# EAGLE design reflow_oven (EAGLE 6.5.0)
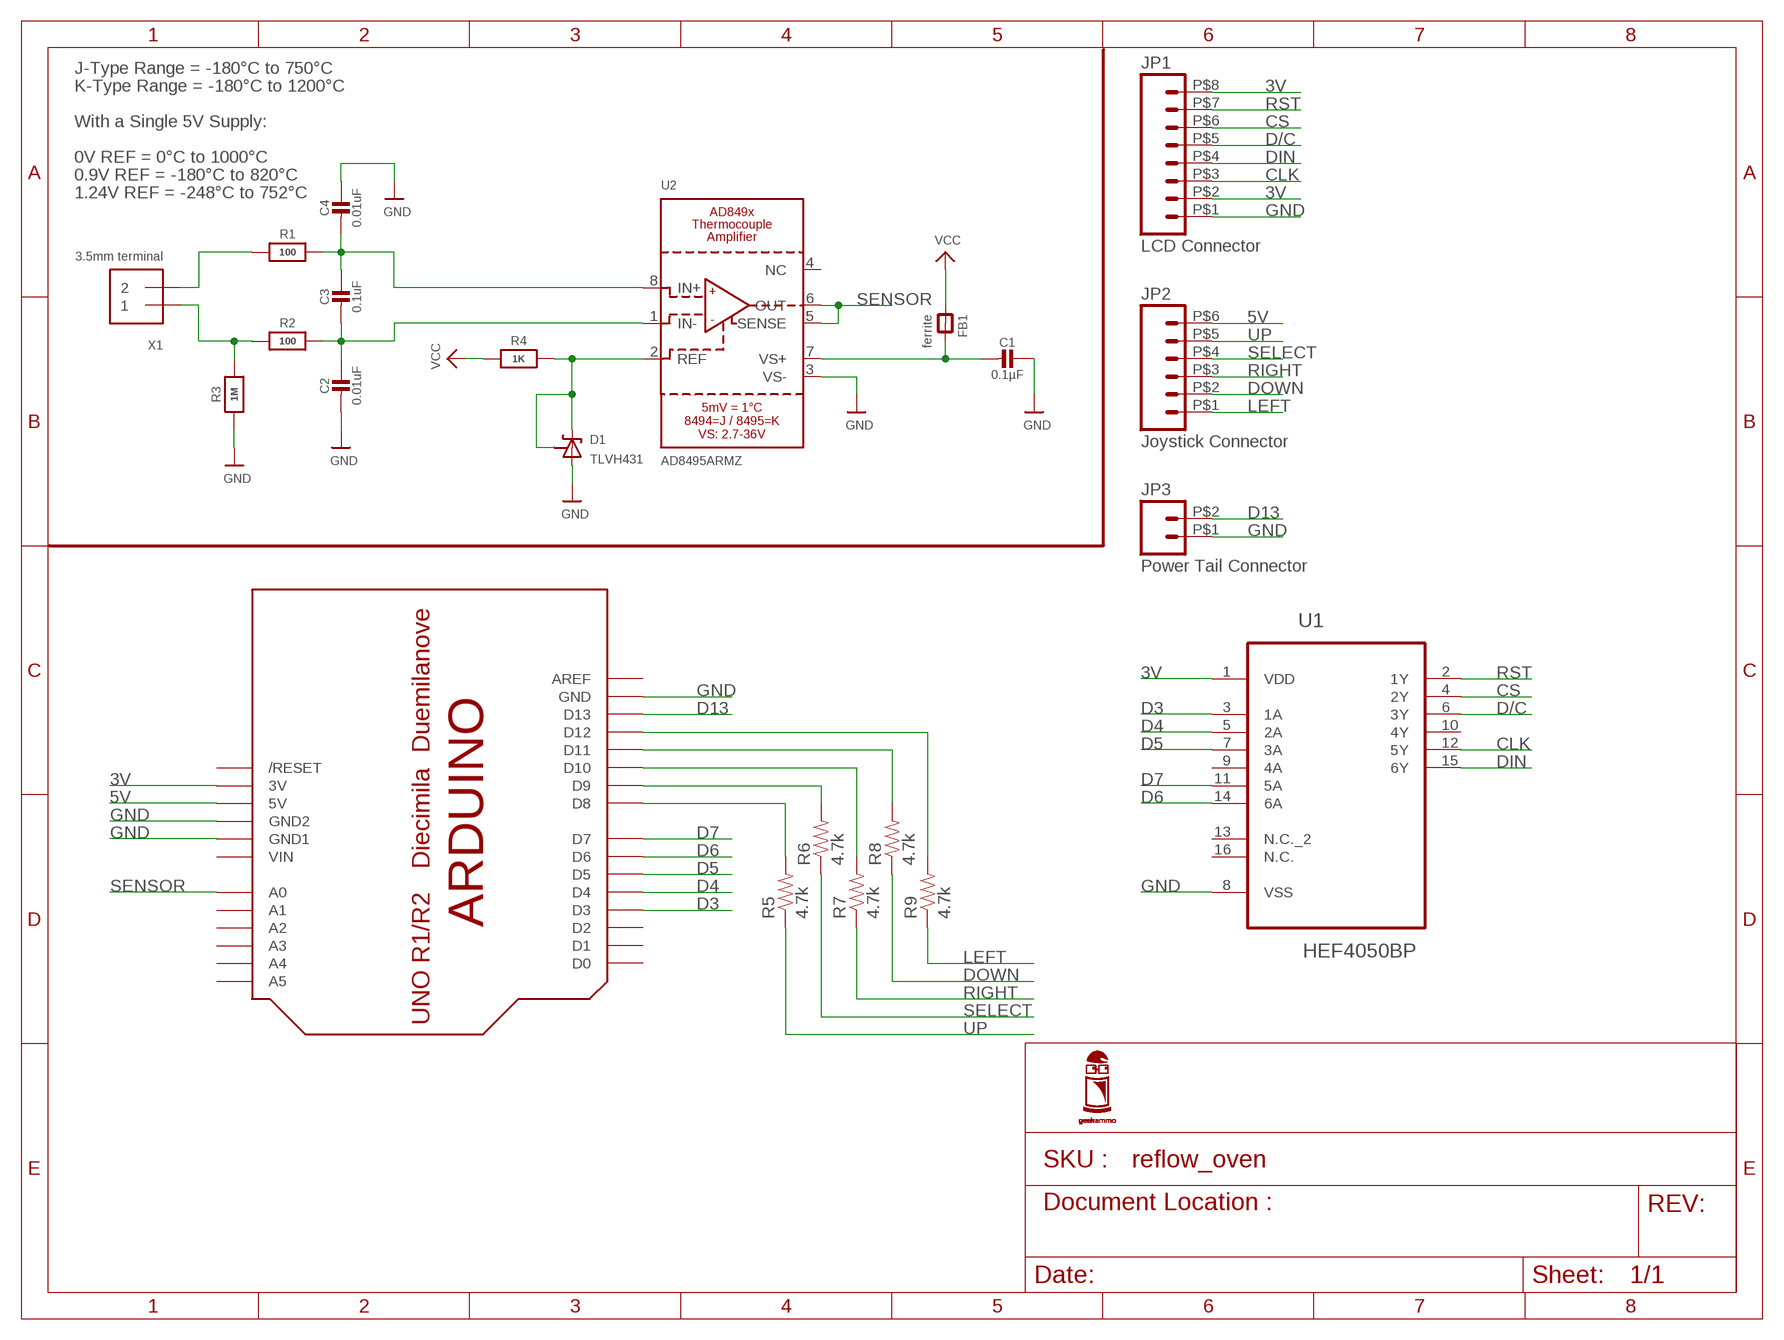
[diagram p0: schematic, sheet 1]

## Parts
C1  0.1µF  CAP_CERAMIC0805-NOOUTLINE  [0805-NO]
C2  0.01uF  CAP_CERAMIC0805-NOOUTLINE  [0805-NO]
C3  0.1uF  CAP_CERAMIC0805-NOOUTLINE  [0805-NO]
C4  0.01uF  CAP_CERAMIC0805-NOOUTLINE  [0805-NO]
D1  TLVH431  SHUNT-VREF  [SOT23-R]
FB1  ferrite  FERRITE0805  [0805]
JP1  LCD Connector  M080.1"-8  [SPRINGTERMINAL-0.1"-8]
JP2  Joystick Connector  M06  [SPRINGTERMINAL-0.1"-6]
JP3  Power Tail Connector  M02SPRING-0.1"  [SPRINGTERMINAL-0.1"-2]
R1  100  RESISTOR0805_NOOUTLINE  [0805-NO]
R2  100  RESISTOR0805_NOOUTLINE  [0805-NO]
R3  1M  RESISTOR0805_NOOUTLINE  [0805-NO]
R4  1K  RESISTOR0805_NOOUTLINE  [0805-NO]
R5  4.7k  RESISTOR0805-RES  [0805]
R6  4.7k  RESISTOR0805-RES  [0805]
R7  4.7k  RESISTOR0805-RES  [0805]
R8  4.7k  RESISTOR0805-RES  [0805]
R9  4.7k  RESISTOR0805-RES  [0805]
U1  HEF4050BP  [DIP254P762X420-16]
U2  AD8495ARMZ  AD849X  [MSOP8_0.65MM]
U$1  ARDUINOUNO  [ARDUINO]
X1  3.5mm terminal  TERMBLOCK_1X2  [TERMBLOCK_1X2-3.5MM]

## Nets
3V: JP1.P$2 JP1.P$8 U1.1(VDD) U$1.3V
5V: JP2.P$6 U$1.5V
CLK: JP1.P$3 U1.12(5Y)
CS: JP1.P$6 U1.4(2Y)
D3: U1.3(1A) U$1.D3
D4: U1.5(2A) U$1.D4
D5: U1.7(3A) U$1.D5
D6: U1.14(6A) U$1.D6
D7: U1.11(5A) U$1.D7
D8: R5.2 U$1.D8
D13: JP3.P$2 U$1.D13
D/C: JP1.P$5 U1.6(3Y)
DIN: JP1.P$4 U1.15(6Y)
DOWN: JP2.P$2 R8.1
GND: C1.1 C2.2 C4.1 D1.3(A) JP1.P$1 JP3.P$1 R3.1 U1.8(VSS) U2.3(VS-) U$1.GND U$1.GND1 U$1.GND2
IN+: R1.1 X1.2
IN-: R2.1 R3.2 X1.1
LEFT: JP2.P$1 R9.1
N$1: D1.1(VREF) D1.2(C) R4.2 U2.2(REF)
N$2: C3.1 C4.2 R1.2 U2.8(IN+)
N$3: C2.1 C3.2 R2.2 U2.1(IN-)
N$4: C1.2 FB1.2 U2.7(VS+)
N$6: R6.2 U$1.D9
N$7: R7.2 U$1.D10
N$8: R8.2 U$1.D11
N$12: R9.2 U$1.D12
RIGHT: JP2.P$3 R7.1
RST: JP1.P$7 U1.2(1Y)
SELECT: JP2.P$4 R6.1
SENSOR: U2.5(SENSE) U2.6(OUT) U$1.A0
UP: JP2.P$5 R5.1
VCC: FB1.1 R4.1
Unconnected: U1.9(4A) U1.10(4Y) U1.13(N.C._2) U1.16(N.C.) U2.4(NC) U$1.A1 U$1.A2 U$1.A3 U$1.A4 U$1.A5 U$1.AREF U$1.D0 U$1.D1 U$1.D2 U$1.RESET(/RESET)

## Notes on the sheet
- J-Type Range = -180°C to 750°C
- K-Type Range = -180°C to 1200°C
- With a Single 5V Supply:
- 0V REF = 0°C to 1000°C
- 0.9V REF = -180°C to 820°C
- 1.24V REF = -248°C to 752°C

## Power pins joined to a net without a drawn wire
VIN: U$1.VIN

## Library data of the parts
C1-C4 = microbuilder:CAP_CERAMIC: Ceramic Capacitors For new designs, use the packages preceded by an '_' character since they are more reliable: The following footprints should be used on most boards: _0402 - Standard footprint for regular board layouts _0603 - Standard footprint for regular board layouts _0805 - Standard footprint for regular board layouts _1206 - Standard footprint for regular board layouts For extremely tight-pitch boards where space is at a premium, the following 'micro-pitch' footprints can be used (smaller pads, no silkscreen outline, etc.): _0402MP - Micro-pitch footprint for very dense/compact boards _0603MP - Micro-pitch footprint for very dense/compact boards _0805MP - Micro-pitch footprint for very dense/compact boards _1206MP - Micro-pitch footprint for very dense/compact boards
D1 = microbuilder:SHUNT-VREF: Shunt Voltage Reference TS3431 - 1.24V Programmable Shunt Voltage Ref. - 1.24-24V, up to 0.25% accuracy, SOT23 (0.25% = Digikey: 497-4637-1-ND) TLVH431 - 1.24V Programmable Shunt Voltage Ref - 1.24-18V, up to 0.50% accuracy, SOT23 (0.50% = Digikey: 296-17687-1-ND See: http://www.ti.com/lit/an/slva445/slva445.pdf
FB1 = microbuilder:FERRITE: Ferrite Bead 0603 MMZ1608B121C - 120 Ohm @ 100MHz, 600mA, 0.15 Ohm DC Resistance - Digikey: 445-2164-1-ND BK1608HW121-T - 120 Ohm, 600mA Ferrite Chip - Digikey: 587-1876-2-ND 0805 HZ0805B272R-10 - 2.7K Ohm @ 100MHz, 200mA, 0.8 Ohm DC Resistance - Digikey: 240-2504-1-ND (see also Murata BLM21BD272SN1L) MMZ2012Y152B - 1.5K Ohm @ 100MHz, 500mA, 0.4 Ohm DC Resistance - Digikey: 445-1560-1-ND - Mainly for high frequency (80-400MHz) MMZ2012R102A - 1K Ohm @ 100MHz, 500mA, 0.3 Ohm DC Resistance - Digikey: 445-1555-2-ND - More general purpose (10-200MHz)
JP1 = SparkFun-Connectors:M08: Header 8 Standard 8-pin 0.1" header. Use with straight break away headers (SKU : PRT-00116), right angle break away headers (PRT-00553), swiss pins (PRT-00743), machine pins (PRT-00117), and female headers (PRT-00115).
JP2 = SparkFun-Connectors:M06: Header 6 Standard 6-pin 0.1" header. Use with straight break away headers (SKU : PRT-00116), right angle break away headers (PRT-00553), swiss pins (PRT-00743), machine pins (PRT-00117), and female headers (PRT-00115). Molex polarized connector foot print use with SKU : PRT-08094 with associated crimp pins and housings. NOTES ON THE VARIANTS LOCK and LOCK_LONGPADS... This footprint was designed to help hold the alignment of a through-hole component (i.e. 6-pin header) while soldering it into place. You may notice that each hole has been shifted either up or down by 0.005 of an inch from it's more standard position (which is a perfectly straight line). This slight alteration caused the pins (the squares in the middle) to touch the edges of the holes. Because they are alternating, it causes a "brace" to hold the component in place. 0.005 has proven to be the perfect amount of "off-center" position when using our standard breakaway headers. Although looks a little odd when you look at the bare footprint, once you have a header in there, the alteration is very hard to notice. Also,if you push a header all the way into place, it is covered up entirely on the bottom side. This idea of altering the position of holes to aid alignment will be further integrated into the Sparkfun Library for other footprints. It can help hold any component with 3 or more connection pins.
JP3 = SparkFun-Connectors:M02: Standard 2-pin 0.1" header. Use with - straight break away headers ( PRT-00116) - right angle break away headers (PRT-00553) - swiss pins (PRT-00743) - machine pins (PRT-00117) - female headers (PRT-00115) Molex polarized connector foot print use with: PRT-08233 with associated crimp pins and housings. 2.54_SCREWTERM for use with PRT-10571. 3.5mm Screw Terminal footprints for PRT-08084 5mm Screw Terminal footprints for use with PRT-08432
R1-R4 = microbuilder:RESISTOR: Resistors For new designs, use the packages preceded by an '_' character since they are more reliable: The following footprints should be used on most boards: _0402 - Standard footprint for regular board layouts _0603 - Standard footprint for regular board layouts _0805 - Standard footprint for regular board layouts _1206 - Standard footprint for regular board layouts For extremely tight-pitch boards where space is at a premium, the following 'micro-pitch' footprints can be used (smaller pads, no silkscreen outline, etc.): _0402MP - Micro-pitch footprint for very dense/compact boards _0603MP - Micro-pitch footprint for very dense/compact boards _0805MP - Micro-pitch footprint for very dense/compact boards _1206MP - Micro-pitch footprint for very dense/compact boards
R5-R9 = SparkFun-Passives:RESISTOR: Resistor Basic schematic elements and footprints for 0603, 1206, and PTH resistors.
U1 = NXP_By_element14_Batch_1:HEF4050BP: Hex non-inverting buffers; MPN: HEF4050BP; OC_FARNELL: 385311; OC_NEWARK: 10WX5444; PACKAGE: DIP-16; SUPPLIER: NXP
U2 = microbuilder:AD849X: AD8494/8495 - Precision Thermocouple Amplifier with Cold Junction Compensation For J-Type Thermocouples use AD8494, For K-Type use AD8495 5 mV/°C thermometer output Single Supply: 2.7 V to 36 V Dual Supply: ±2.7 V to ±18 V
U$1 = adafruit:ARDUINO: Arduino Diecimila/Duemilanove Make a shield with ease, this package has all the named pins as well as the two mounting drill holes and an outline of the USB and DC power connector. The outline is on the DIMENSION layer, so if your board house uses it they will cut the outline to match. http://www.ladyada.net/library/pcb/eaglelibrary.html
X1 = microbuilder:TERMBLOCK_1X2: 3.5mm Terminal block http://www.ladyada.net/library/pcb/eaglelibrary.html

## Board
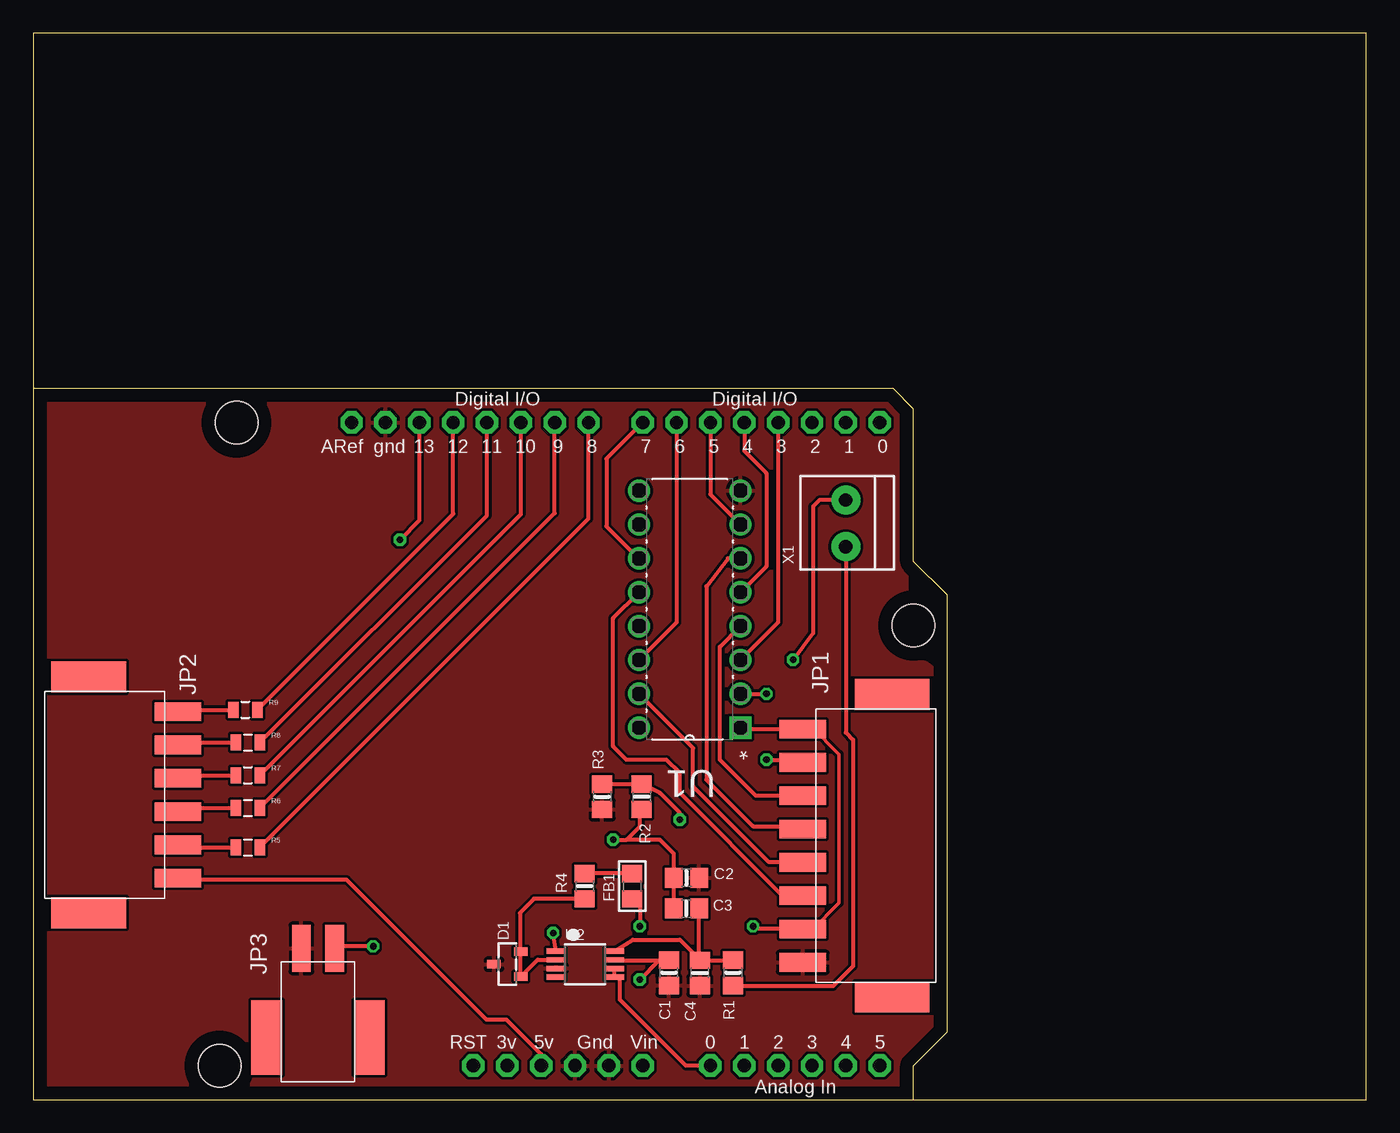
[diagram p1: board, top side]
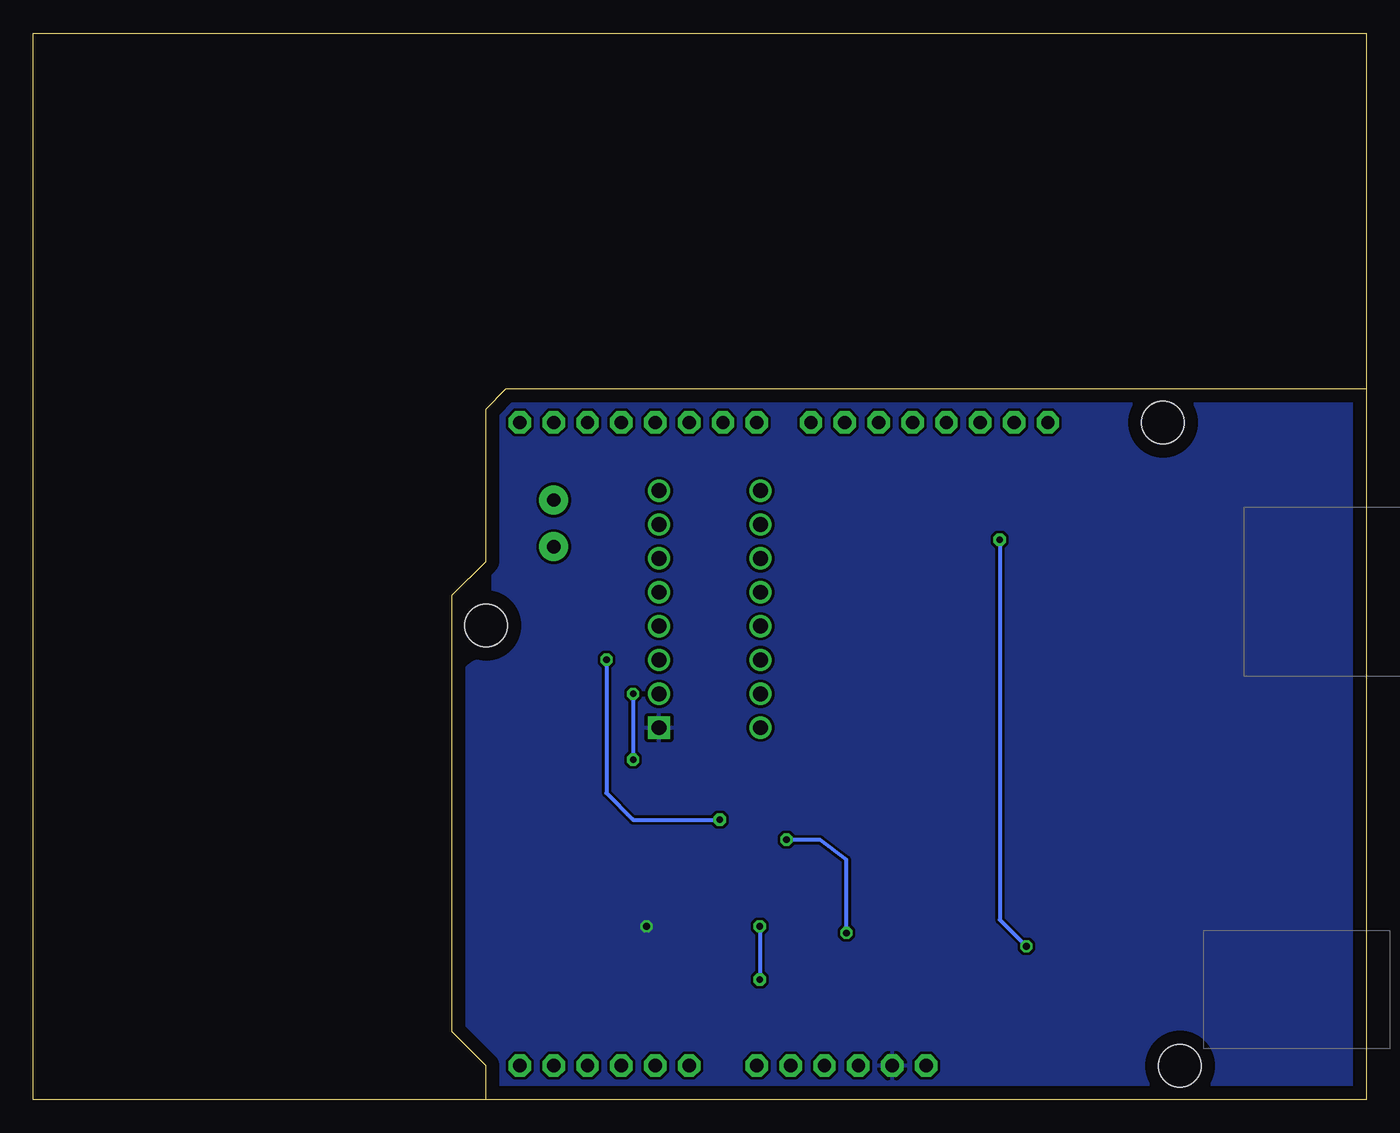
[diagram p2: board, bottom side, seen from below]

Size 100 x 80 mm. Coordinates in mm from the lower left corner, seen from the top.
Outline: 0,0 100,0 100,80 0,80 0,0
Copper layers (1*16): Top 0.035mm / dielectric 1.5mm / Bottom 0.035mm
Design rules "default": minimum track width 10mil, minimum drill 24mil, track to track 8mil, track to pad 8mil, pad to pad 8mil, via to via 8mil, smd to smd 8mil, copper to edge 40mil, drill to drill 8mil, minimum pad ring 10mil, minimum via ring 8mil, stop-mask expansion 4mil, vias tented up to drill 0mil, thermal gap 10mil

### Footprints (pad centres in the part's own frame; a part is rotated, then mirrored left to right if it is on the bottom)
0805-NO = smd 1.3 x 1.5: 1 -0.95,0; 2 0.95,0
SOT23-R = smd 0.635 x 1.016: 1 -0.95,-1; 2 0.95,-1; 3 0,1
0805 = smd 1.3 x 1.5: 1 -0.95,0; 2 0.95,0
SPRINGTERMINAL-0.1"-8 = smd 1.4 x 3.5: P$1 -8.75,4.5; P$2 -6.25,4.5; P$3 -3.75,4.5; P$4 -1.25,4.5; P$5 1.25,4.5; P$6 3.75,4.5; P$7 6.25,4.5; P$8 8.75,4.5 | smd 2.3 x 5.6: P$9 -11.35,-2.2; P$10 11.35,-2.2
SPRINGTERMINAL-0.1"-6 = smd 1.4 x 3.5: P$1 -6.25,4.5; P$2 -3.75,4.5; P$3 -1.25,4.5; P$4 1.25,4.5; P$5 3.75,4.5; P$6 6.25,4.5 | smd 2.3 x 5.6: P$9 -8.85,-2.2; P$10 8.85,-2.2
SPRINGTERMINAL-0.1"-2 = smd 1.4 x 3.5: P$1 -1.25,4.5; P$2 1.25,4.5 | smd 2.3 x 5.6: P$9 -3.85,-2.2; P$10 3.85,-2.2
0805' = smd 0.8 x 1.2: 1 -0.9,0; 2 0.9,0
DIP254P762X420-16 = drill 1.118 square: 1 -7.62,17.78 | drill 1.118: 2 -7.62,15.24; 3 -7.62,12.7; 4 -7.62,10.16; 5 -7.62,7.62; 6 -7.62,5.08; 7 -7.62,2.54; 8 -7.62,0; 9 0,0; 10 0,2.54; 11 0,5.08; 12 0,7.62; 13 0,10.16; 14 0,12.7; 15 0,15.24; 16 0,17.78
MSOP8_0.65MM = smd 0.4 x 1.4: 1 -0.975,-2.2; 2 -0.325,-2.2; 3 0.325,-2.2; 4 0.975,-2.2; 5 0.975,2.2; 6 0.325,2.2; 7 -0.325,2.2; 8 -0.975,2.2
ARDUINO = drill 1 pad 1.676 octagon: 3V 35.56,2.54; 5V 38.1,2.54; A0 50.8,2.54; A1 53.34,2.54; A2 55.88,2.54; A3 58.42,2.54; A4 60.96,2.54; A5 63.5,2.54; AREF 23.876,50.8; D0 63.5,50.8; D1 60.96,50.8; D2 58.42,50.8; D3 55.88,50.8; D4 53.34,50.8; D5 50.8,50.8; D6 48.26,50.8; D7 45.72,50.8; D8 41.656,50.8; D9 39.116,50.8; D10 36.576,50.8; D11 34.036,50.8; D12 31.496,50.8; D13 28.956,50.8; GND 26.416,50.8; GND1 43.18,2.54; GND2 40.64,2.54; RESET 33.02,2.54; VIN 45.72,2.54 | hole 3.2: 15.24,50.8; 66.04,35.56; 13.97,2.54
TERMBLOCK_1X2-3.5MM = drill 1 pad 2.184: 1 1.8,0; 2 -1.7,0

### Placement (x,y rotation side)
C1  47.68,9.51 90 top
C2  49,16.64 0 top
C3  49,14.33 180 top
C4  50,9.5 90 top
D1  35.56,10.16 90 top
FB1  44.93,16.01 270 top
JP1  62.23,19.05 90 top
JP2  6.35,22.86 270 top
JP3  21.36,6.85 0 top
R1  52.49,9.51 90 top
R2  45.64,22.72 270 top
R3  42.68,22.72 90 top
R4  41.37,16.01 270 top
R5  4.7k  [0805']  16.09,18.91 0 top
R6  4.7k  [0805']  16.09,21.87 0 top
R7  4.7k  [0805']  16.09,24.33 0 top
R8  4.7k  [0805']  16.09,26.79 0 top
R9  4.7k  [0805']  15.91,29.25 0 top
U1  45.44,45.68 180 top
U2  41.41,10.16 270 top
U$1  0,0 0 top
X1  60.96,43.18 90 top

### Tracks (layer width: path | path; a pad name or v marks a point on that pad's centre or on a via)
3V  (via drill 0.5)
  Top 0.254: JP1.P$2 58.42,12.7 60.46,14.74 60.46,25.9 58.42,27.94 JP1.P$8
  Top 0.305: JP1.P$2 54.2,12.8 v54,13 | U1.1 53.16,27.8 JP1.P$8
  pour Bottom: 0.5,53 64,53 65.5,51.5 65.5,38 arc90 64,36.5 64,35.5 64,34.5 arc90 65.5,33 66,33 arc-90 68,31 68,5.5 65.5,3 65.5,0.5 0.5,0.5
5V
  Top 0.305: U$1.5V 38.1,3.4 35.5,6 34,6 23.5,16.5 10.96,16.5 JP2.P$6
CLK
  Top 0.305: JP1.P$3 56.2,15.3 48.5,23 48.5,24.5 47.5,25.5 44.5,25.5 43.5,26.5 43.5,36.12 U1.12
CS
  Top 0.305: JP1.P$6 54.2,22.8 51.5,25.5 51.5,33.96 U1.4
D3
  Top 0.305: U$1.D3 55.88,35.8 U1.3
D4
  Top 0.305: U$1.D4 53.34,48.66 55,47 55,40 U1.5
D5
  Top 0.305: U$1.D5 50.8,45.4 U1.7
D6
  Top 0.305: U$1.D6 48.26,35.8 U1.14
D7
  Top 0.305: U$1.D7 43,48.08 43,43 45.4,40.6 U1.11
D8
  Top 0.305: R5.2 41.66,43.58 U$1.D8
D13  (via drill 0.5)
  Top 0.305: U$1.D13 28.96,43.46 v27.5,42 | v25.5,11.5 22.76,11.5 JP3.P$2
  Bottom 0.305: v27.5,42 27.5,13.5 v25.5,11.5
D/C
  Top 0.305: U1.6 52.1,40.6 50.5,38.5 50.5,24 54,20.5 57.53,20.5 JP1.P$5
DIN
  Top 0.305: JP1.P$4 55.2,17.8 49.5,23.5 49.5,26.38 U1.15
DOWN
  Top 0.305: JP2.P$2 10.85,26.79 R8.1
GND
  pour Top: 0.5,53 64,53 65.5,51.5 65.5,38 arc90 64,36.5 64,35.5 64,34.5 arc90 65.5,33 66,33 arc-90 68,31 68,6 68,5.5 65.5,3 65.5,0.5 0.5,0.5
IN+
  Top 0.305: X1.2 60.96,27.54 61.5,27 61.5,10 60,8.5 52.55,8.5 R1.1
IN-  (via drill 0.5)
  Top 0.305: R3.2 R2.1 47,23 48.5,21.5 v48.5,21 | X1.1 58.98,44.98 58.5,44.5 58.5,35 v57,33
  Bottom 0.305: v48.5,21 55,21 57,23 v57,33
LEFT
  Top 0.305: JP2.P$1 10.99,29.25 R9.1
N$1
  Top 0.305: U2.2 37.84,10.48 D1.1 D1.2 36.5,11.17 36.5,14 37.56,15.06 R4.2
N$2
  Top 0.305: U2.8 44.98,12 48.5,12 50,10.5 C4.2 | C4.2 49.95,10.5 C3.1 | C4.2 R1.2
N$3  (via drill 0.5)
  Top 0.305: C3.2 C2.1 48.05,18.45 47,19.5 44.5,19.5 | U2.1 v39,12.5 | v43.5,19.5 44.5,19.5 | 44.5,19.5 45.5,20.5 45.5,21.63 R2.2
  Bottom 0.305: v39,12.5 39,18 41,19.5 v43.5,19.5
N$4  (via drill 0.5)
  Top 0.305: FB1.2 45.5,14.49 v45.5,13 | v45.5,9 46.96,10.46 C1.2 43.63,10.46 U2.7
  Bottom 0.305: v45.5,13 v45.5,9
N$6
  Top 0.305: R6.2 39.12,44 U$1.D9
N$7
  Top 0.305: R7.2 36.58,43.92 U$1.D10
N$8
  Top 0.305: R8.2 34.04,43.84 U$1.D11
N$10  (via drill 0.5)
  other vias: 43.5,19.5
N$11  (via drill 0.5)
  other vias: 45.5,13
N$12
  Top 0.305: R9.2 31.5,43.94 U$1.D12
N$15  (via drill 0.5)
  other vias: 48.5,21
N$18  (via drill 0.5)
  other vias: 45.5,9
RIGHT
  Top 0.305: JP2.P$3 10.85,24.33 R7.1
RST  (via drill 0.5)
  Top 0.305: U1.2 v55,30.44 | v55,25.5 57.73,25.5 JP1.P$7
  Bottom 0.305: v55,30.44 v55,25.5
SELECT
  Top 0.305: JP2.P$4 10.85,21.87 R6.1
SENSOR
  Top 0.305: U$1.A0 48.96,2.54 44,7.5 44,9.07 U2.5 U2.6
UP
  Top 0.305: JP2.P$5 10.85,18.91 R5.1
VCC
  Top 0.305: FB1.1 R4.1